# Altium schematic sheet 01_REVISION_HISTORY.SchDoc: =TitleParameter
size A3; Organization: ASISGUARD; Address1: Kemalpasa, Kemalpasa Cd. No:290 D:292H, 35060 Bornova/Izmir/Turkey
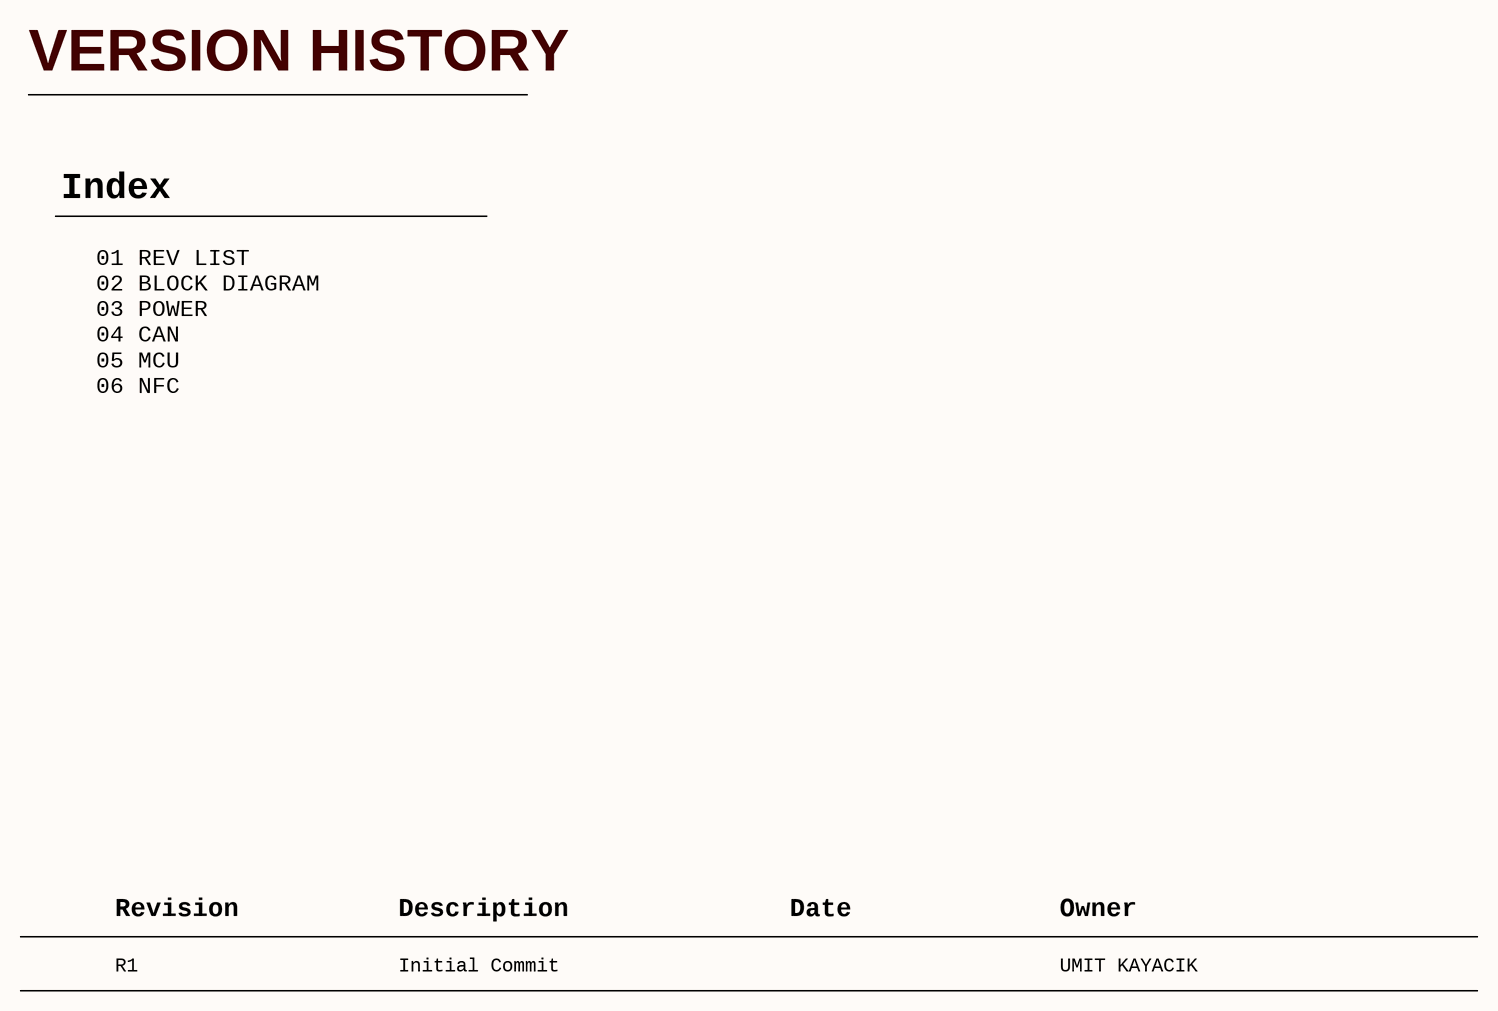
[diagram p0: 01_REVISION_HISTORY.SchDoc]

## Notes on the sheet
- VERSION HISTORY
- Index
- 01 REV LIST
  02 BLOCK DIAGRAM
  03 POWER
  04 CAN
  05 MCU
  06 NFC
- Revision
- Description
- Date
- Owner
- R1
- Initial Commit
- UMIT KAYACIK
- Proje/Project:
- Sayfa Adı/Document Name:
- Çizilme Tarihi/Drawing Date
- Umit KAYACIK
- Tasarlayan/Designed By
- Sayfa/Sheet:
- Revision:
- of
- Son Güncelleme/Last Edit Date
- Kontrol eden/Checked By
- Onaylayan/Approved By
- Boyut/Size:
- Varyant/Variant:
- Dil/Language:
- A3
- ENG